# EAGLE design FlexPCB_Linear (EAGLE 9.6.2)
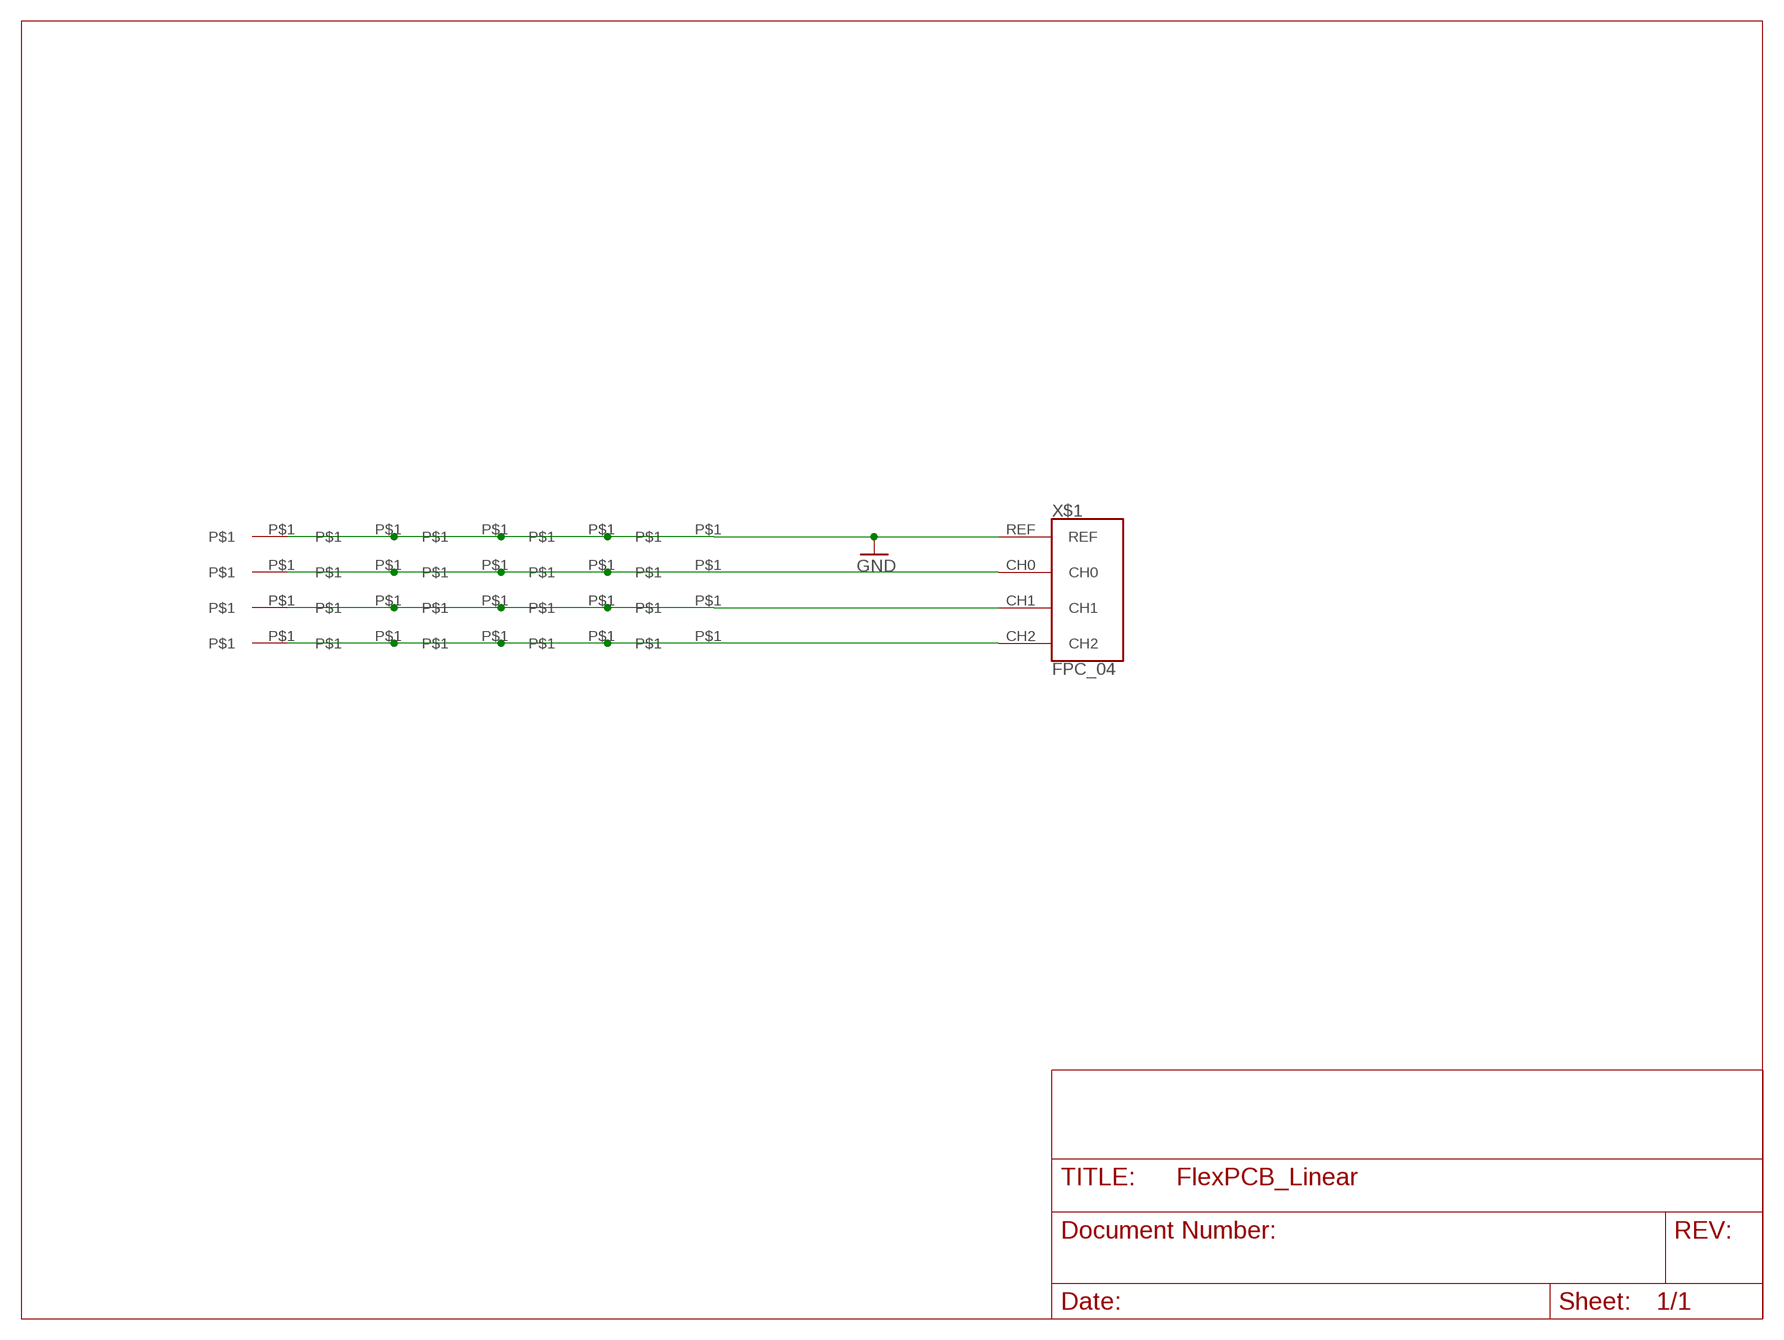
[diagram p0: schematic, sheet 1]

## Parts
U$1  CONN  [CONN]
U$2  CONN  [CONN]
U$3  CONN  [CONN]
U$4  CONN  [CONN]
U$5  CONN  [CONN]
U$6  CONN  [CONN]
U$7  CONN  [CONN]
U$8  CONN  [CONN]
U$9  CONN  [CONN]
U$10  CONN  [CONN]
U$11  CONN  [CONN]
U$12  CONN  [CONN]
U$13  CONN  [CONN]
U$14  CONN  [CONN]
U$15  CONN  [CONN]
U$16  CONN  [CONN]
U$17  CONN  [CONN]
U$18  CONN  [CONN]
U$19  CONN  [CONN]
U$20  CONN  [CONN]
X$1  FPC_04  [FPC_04]

## Nets
GND: U$1.P$1 U$5.P$1 U$9.P$1 U$13.P$1 U$17.P$1 X$1.REF
N$2: U$2.P$1 U$6.P$1 U$10.P$1 U$14.P$1 U$18.P$1 X$1.CH0
N$3: U$3.P$1 U$7.P$1 U$11.P$1 U$15.P$1 U$19.P$1 X$1.CH1
N$4: U$4.P$1 U$8.P$1 U$12.P$1 U$16.P$1 U$20.P$1 X$1.CH2

## Library data of the parts
U$1-U$20 = IonSensor:CONN
X$1 = IonSensor:FPC_04: FPC Connector for Ion Sensor

## Net classes
0 default: width 0.305 mm

## Board
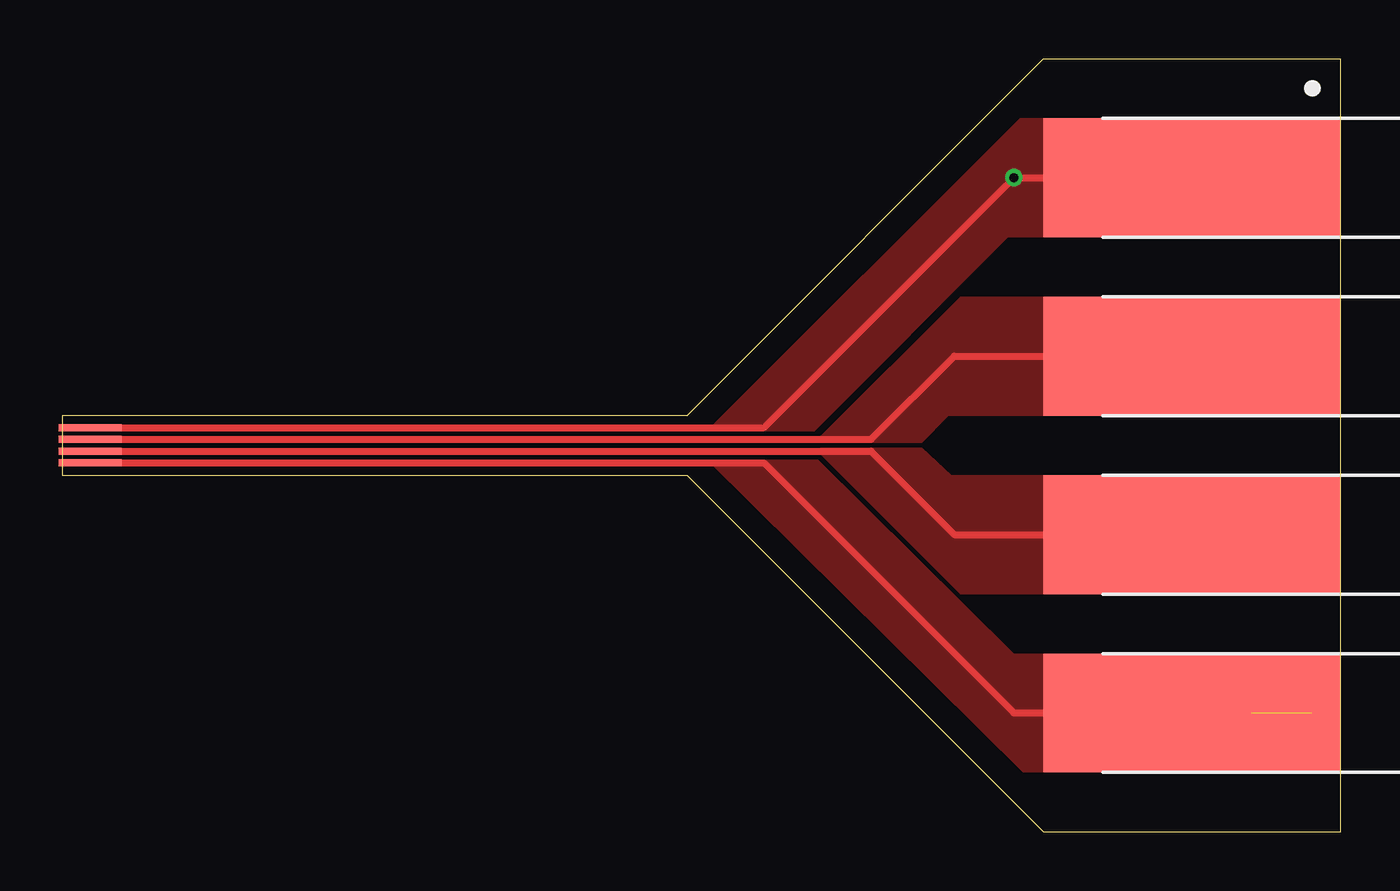
[diagram p1: board, top side]
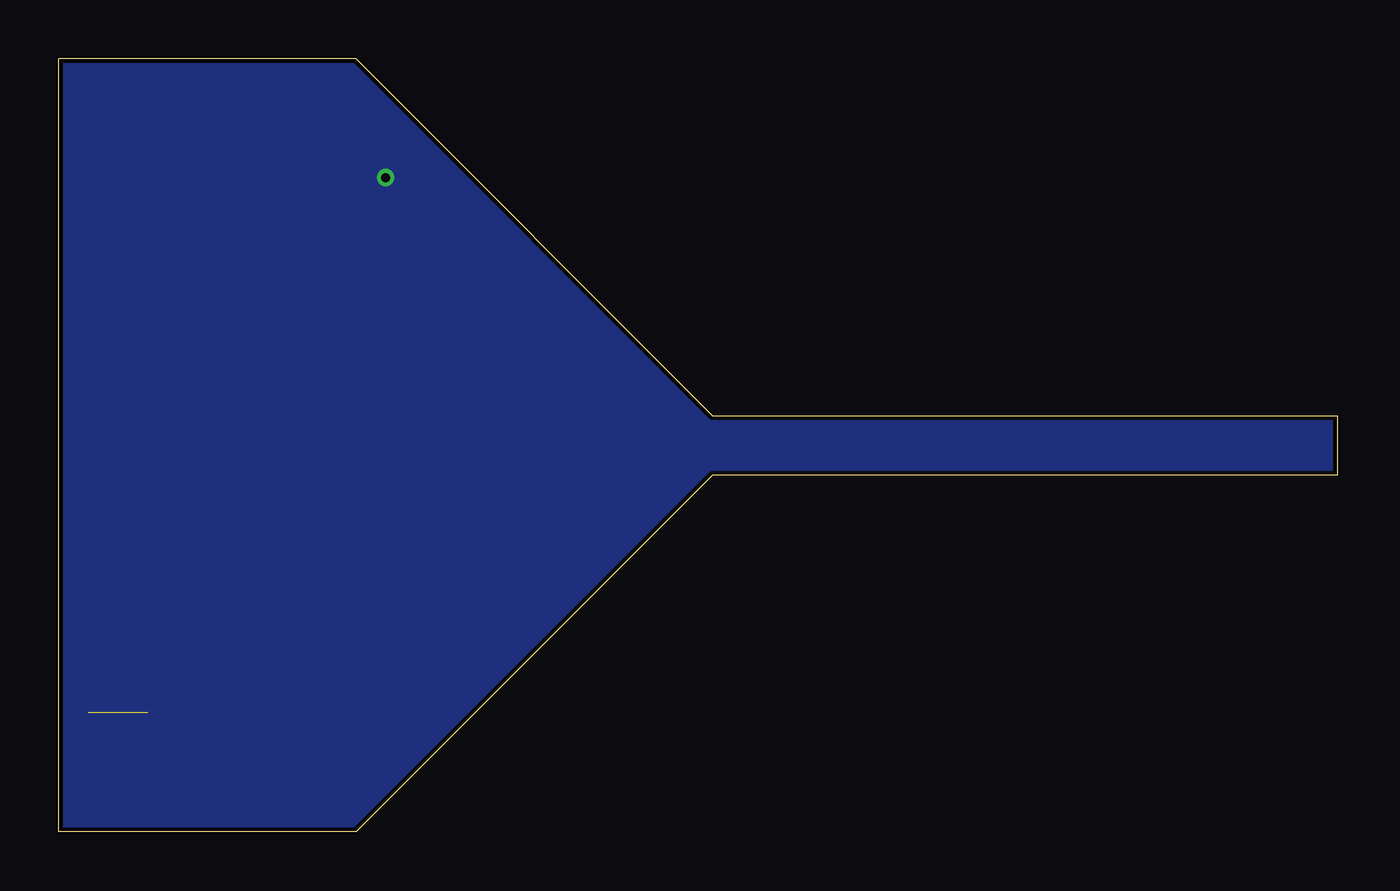
[diagram p2: board, bottom side, seen from below]

Size 54.61 x 33.02 mm. Coordinates in mm from the lower left corner, seen from the top.
Outline: 0,17.78 0,15.24 26.67,15.24 41.91,0 54.61,0 54.61,33.02 41.91,33.02 26.67,17.78 0,17.78
Copper layers (1*16): Top 0.035mm / dielectric 1.5mm / Bottom 0.035mm
Design rules "SparkFun-2-Layer-General-JLCPCB": minimum track width 7mil, minimum drill 0.3mm, track to track 7mil, track to pad 7mil, pad to pad 7mil, via to via 7mil, smd to smd 7mil, copper to edge 7mil, drill to drill 7mil, minimum pad ring 7mil, minimum via ring 7mil, stop-mask expansion 3mil, vias tented up to drill 25mil, thermal gap 10mil

### Footprints (pad centres in the part's own frame; a part is rotated, then mirrored left to right if it is on the bottom)
CONN = smd 5.08 x 2.54: P$1 0,0
FPC_04 = smd 2.7 x 0.3: CH0 -1.35,0.25; CH1 -1.35,-0.25; CH2 -1.35,-0.75; REF -1.35,0.75

### Placement (x,y rotation side)
U$1  43.18,27.94 90 top
U$2  43.18,20.32 90 top
U$3  43.18,12.7 90 top
U$4  43.18,5.08 90 top
U$5  45.72,27.94 90 top
U$6  45.72,20.32 90 top
U$7  45.72,12.7 90 top
U$8  45.72,5.08 90 top
U$9  48.26,27.94 90 top
U$10  48.26,20.32 90 top
U$11  48.26,12.7 90 top
U$12  48.26,5.08 90 top
U$13  50.8,27.94 90 top
U$14  50.8,20.32 90 top
U$15  50.8,12.7 90 top
U$16  50.8,5.08 90 top
U$17  53.34,27.94 90 top
U$18  53.34,20.32 90 top
U$19  53.34,12.7 90 top
U$20  53.34,5.08 90 top
X$1  2.54,16.51 0 top

### Tracks (layer width: path | path; a pad name or v marks a point on that pad's centre or on a via)
GND  (via drill 0.38)
  Top 0.305: X$1.REF 29.96,17.26 v40.64,27.94 U$1.P$1 U$5.P$1 U$9.P$1 U$13.P$1 U$17.P$1
  pour Bottom (no thermals): -1.27,-1.27 55.88,-1.27 55.88,34.29 -1.27,34.29
  pour Top (no thermals): 43.18,30.48 40.89,30.48 27.56,17.15 27.56,17.11 32.13,17.11 40.39,25.4 43.18,25.4
N$2
  Top 0.305: X$1.CH0 34.54,16.76 38.1,20.32 U$2.P$1 U$6.P$1 U$10.P$1 U$14.P$1 U$18.P$1
  pour Top (no thermals): 43.18,22.86 38.35,22.86 32.38,16.89 32.38,16.61 36.7,16.61 37.85,17.78 43.18,17.78
N$3
  Top 0.305: X$1.CH1 34.54,16.26 38.1,12.7 U$3.P$1 U$7.P$1 U$11.P$1 U$15.P$1 U$19.P$1
  pour Top (no thermals): 43.18,15.24 37.97,15.24 36.7,16.41 32.38,16.41 32.38,16.13 38.35,10.16 43.18,10.16
N$4  (1 unrouted)
  Top 0.305: X$1.CH2 29.96,15.76 40.64,5.08 U$4.P$1 U$8.P$1 U$12.P$1 U$16.P$1
  pour Top (no thermals): 43.18,7.62 40.64,7.62 32.26,15.91 27.56,15.88 41.02,2.54 43.18,2.54

### Text on the board
tPlace: •